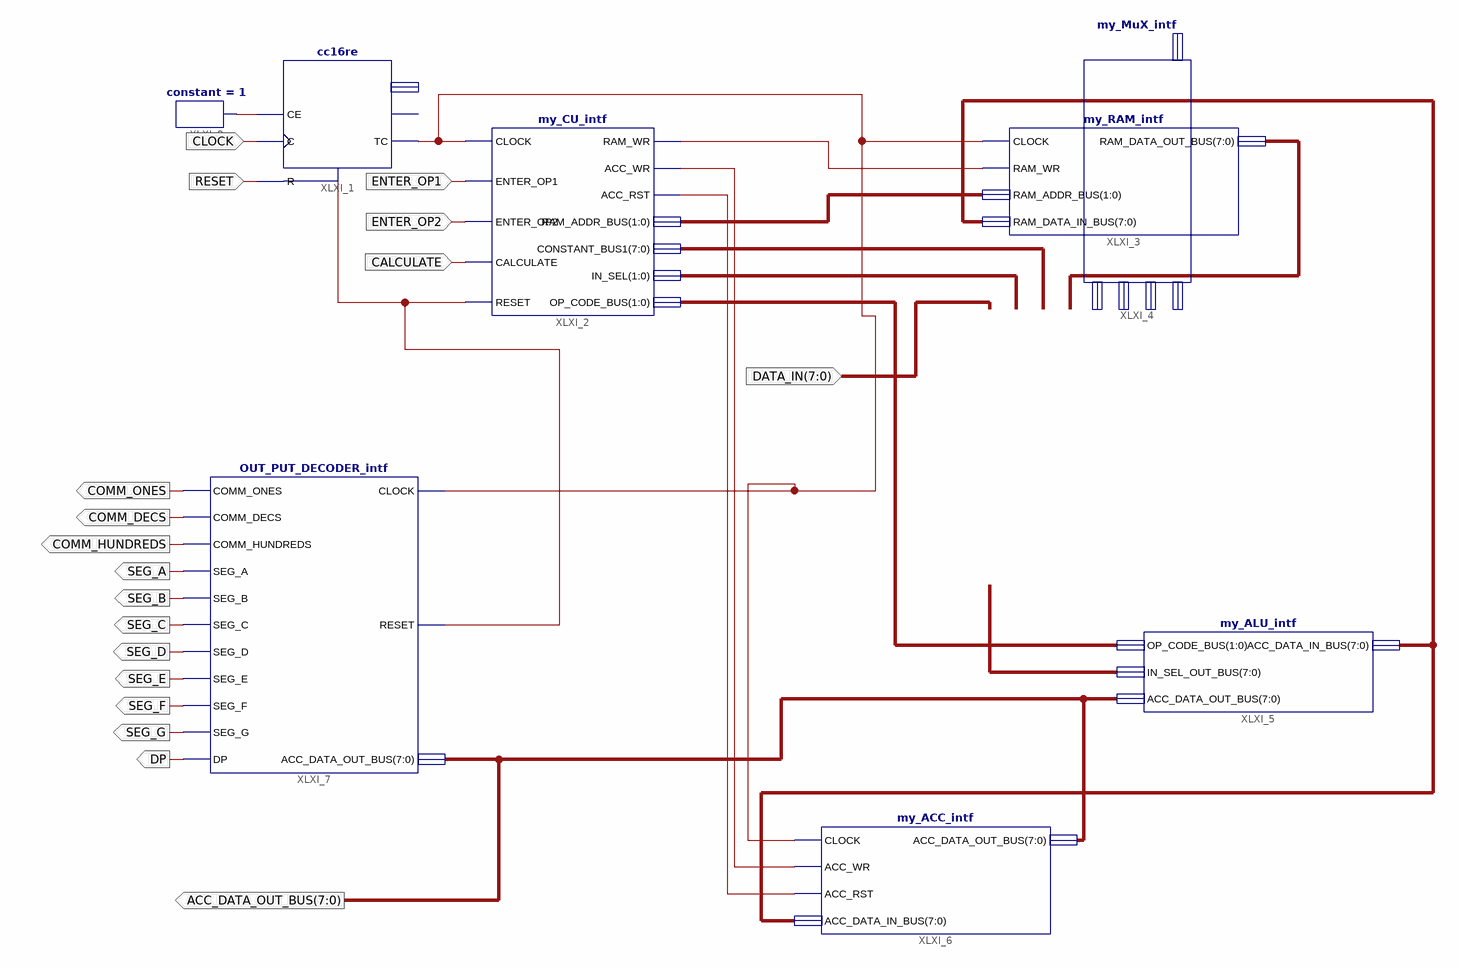
[diagram p0: schematic sheet 1]
// Xilinx ISE schematic TopLevel.sch (spartan3a) as structural Verilog: 8 symbols, 18 ports
module TopLevel (
  input  CLOCK,
  input  RESET,
  input  ENTER_OP1,
  input  ENTER_OP2,
  input  CALCULATE,
  input  [7:0] DATA_IN,
  output [7:0] ACC_DATA_OUT_BUS,
  output DP,
  output SEG_G,
  output SEG_F,
  output SEG_E,
  output SEG_D,
  output SEG_C,
  output SEG_B,
  output SEG_A,
  output COMM_HUNDREDS,
  output COMM_DECS,
  output COMM_ONES
);

  wire XLXN_1, XLXN_2, XLXN_8, XLXN_11, XLXN_12, XLXN_34;
  wire [1:0] XLXN_3, XLXN_5, XLXN_16;
  wire [7:0] XLXN_4, XLXN_6, XLXN_13, XLXN_15;

  cc16re XLXI_1 (.C(CLOCK), .CE(XLXN_34), .R(RESET), .TC(XLXN_1));  // open: CEO, Q
  my_CU_intf XLXI_2 (
    .CLOCK(XLXN_1), .ENTER_OP1(ENTER_OP1), .ENTER_OP2(ENTER_OP2), .CALCULATE(CALCULATE), .RESET(XLXN_8),
    .RAM_WR(XLXN_2), .ACC_WR(XLXN_11), .ACC_RST(XLXN_12), .RAM_ADDR_BUS(XLXN_3), .CONSTANT_BUS1(XLXN_6),
    .IN_SEL(XLXN_5), .OP_CODE_BUS(XLXN_16));
  my_RAM_intf XLXI_3 (
    .CLOCK(XLXN_1), .RAM_WR(XLXN_2), .RAM_ADDR_BUS(XLXN_3), .RAM_DATA_IN_BUS(XLXN_13),
    .RAM_DATA_OUT_BUS(XLXN_4));
  my_MuX_intf XLXI_4 (
    .DATA_IN(DATA_IN), .IN_SEL(XLXN_5), .CONSTANT_BUS1(XLXN_6), .RAM_DATA_OUT_BUS(XLXN_4),
    .IN_SEL_OUT_BUS(XLXN_15));
  my_ALU_intf XLXI_5 (
    .OP_CODE_BUS(XLXN_16), .IN_SEL_OUT_BUS(XLXN_15), .ACC_DATA_OUT_BUS(ACC_DATA_OUT_BUS),
    .ACC_DATA_IN_BUS(XLXN_13));
  my_ACC_intf XLXI_6 (
    .CLOCK(XLXN_1), .ACC_WR(XLXN_11), .ACC_RST(XLXN_12), .ACC_DATA_IN_BUS(XLXN_13),
    .ACC_DATA_OUT_BUS(ACC_DATA_OUT_BUS));
  OUT_PUT_DECODER_intf XLXI_7 (
    .CLOCK(XLXN_1), .RESET(XLXN_8), .ACC_DATA_OUT_BUS(ACC_DATA_OUT_BUS), .COMM_ONES(COMM_ONES),
    .COMM_DECS(COMM_DECS), .COMM_HUNDREDS(COMM_HUNDREDS), .SEG_A(SEG_A), .SEG_B(SEG_B), .SEG_C(SEG_C),
    .SEG_D(SEG_D), .SEG_E(SEG_E), .SEG_F(SEG_F), .SEG_G(SEG_G), .DP(DP));
  constant #(.CValue("1")) XLXI_8 (.O(XLXN_34));
endmodule
